# EAGLE design lipo_charger (EAGLE 7.5.0)
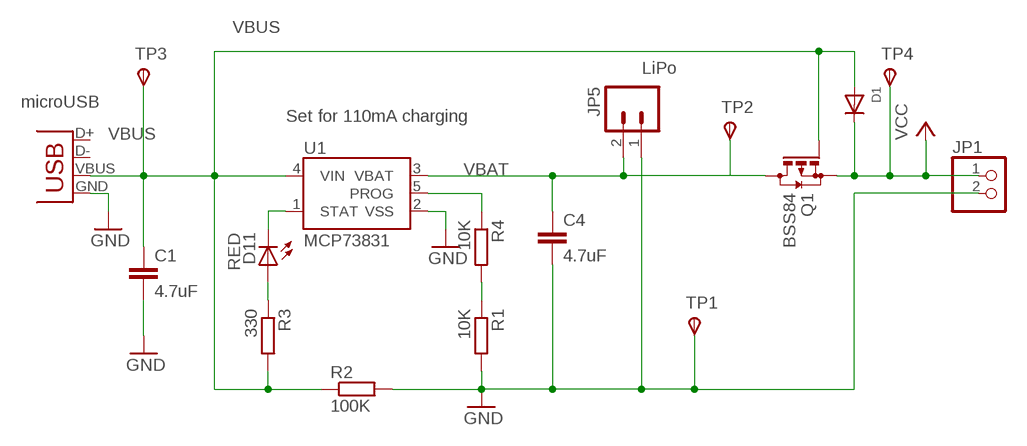
[diagram p0: schematic, sheet 1]

## Parts
C1  4.7uF  C-EUC0805  [C0805]
C4  4.7uF  C-EUC0805  [C0805]
D1  DIODESOD-123  [SOD-123]
D11  RED  LED1206  [LED-1206]
JP1  PINHD-1X2  [1X02]
JP5  LiPo  M02JST-PTH-2  [JST-2-PTH]
Q1  BSS84  [SOT23]
R1  10K  R-EU_R0805  [R0805]
R2  100K  R-EU_R0805  [R0805]
R3  330  R-EU_R0805  [R0805]
R4  10K  R-EU_R0805  [R0805]
TP1  TPSTP09R  [TP09R]
TP2  TPSTP09R  [TP09R]
TP3  TPSTP09R  [TP09R]
TP4  TPSTP09R  [TP09R]
U1  MCP73831  [SOT23-5]
X1  Mini USB B  USBOLD  [USB-MINIB-OLD]

## Nets
N$3: D11.A R3.1
PROG: R4.1 U1.5(PROG)
PROGA: R1.1 R4.2
STAT: D11.C U1.1(STAT)
VBAT [VCC]: C4.1 JP5.2 Q1.3(D) TP2.TP(PP) U1.3(VBAT)
VBUS [VCC]: C1.1 D1.A Q1.1(G) R2.1 R3.2 TP3.TP(PP) U1.4(VIN) X1.VBUS
VCC [VCC]: D1.C JP1.1 Q1.2(S) TP4.TP(PP)
VSS [GND]: C1.2 C4.2 JP1.2 JP5.1 R1.2 R2.2 TP1.TP(PP) U1.2(VSS) X1.GND ; supply symbol labelled GND
Unconnected: X1.D+ X1.D-

## Notes on the sheet
- microUSB
- Set for 110mA charging

## Library data of the parts
C1 C4 = resistor:C-EU: CAPACITOR, European symbol
D1 = adafruit:DIODE: Diode SMADIODE - SMA Surface Mount Package 20V 1A Schottky Diode Digikey: 641-1014-6-ND DO-1N4148 - Through Hole Small Current Diode SOD-123 20V 1 A (.5mV Vf) Schottky Diode - Digikey: MBRX120TPMSCT-ND SOD-323 10V 570mA (.38mV Vf, 3ns) Schottky Diode - Digikey: ZLLS410CT-ND SOD-523 30V 30mA Schottky Diode (RB751S-40TE61) - Digikey: RB751S-40TE61CT-ND SOT23-R/W - SOT23 Package (R = Solder Paste/Reflow Ovens, W = Hand-Soldering) BAT54Film 40V 300mA - Digikey: 497-7162-1-ND
D11 = SparkFun:LED: LEDs Standard schematic elements and footprints for 5mm, 3mm, 1206, and 0603 sized LEDs. 5mm - Spark Fun Electronics SKU : COM-00529 (and others)
JP1 = pinhead:PINHD-1X2: PIN HEADER
JP5 = SparkFun:M02: Header 2 Standard 2-pin 0.1" header. Use with straight break away headers (SKU : PRT-00116), right angle break away headers (PRT-00553), swiss pins (PRT-00743), machine pins (PRT-00117), and female headers (PRT-00115). Molex polarized connector foot print use with SKU : PRT-08233 with associated crimp pins and housings.
Q1 = transistor-small-signal:BSS84: P-CHANNEL MOS FET
R1-R4 = resistor:R-EU_: RESISTOR, European symbol
TP1-TP4 = testpad:TPS: TEST PIN
U1 = SparkFun:MCP73831: Microchip's MCP73831 Miniature single cell, fully integrated Li-Ion, Li-polymer charge management controller http://ww1.microchip.com/downloads/en/DeviceDoc/21984a.pdf
X1 = SparkFun:USB: USB Connectors USB-B-PTH is fully proven SKU : PRT-00139 USB-miniB is fully proven SKU : PRT-00587 USB-A-PCB is untested. USB-A-H is throughly reviewed, but untested. Spark Fun Electronics SKU : PRT-00437 USB-B-SMT is throughly reviewed, but untested. Needs silkscreen touching up. USB-A-S has not been used/tested USB-MB-H has not been used/tested

## Net classes
0 default: width 0.305 mm, drill 0.508 mm, clearance 0.178 mm
1 GND: width 0.762 mm, drill 0.508 mm, clearance 0.178 mm
2 VCC: width 0.762 mm, drill 0.508 mm, clearance 0.178 mm
3 AD: width 0.305 mm, drill 0.508 mm, clearance 0.178 mm
4 VCCEXT: width 0.762 mm, drill 0.508 mm, clearance 0.178 mm

## Board
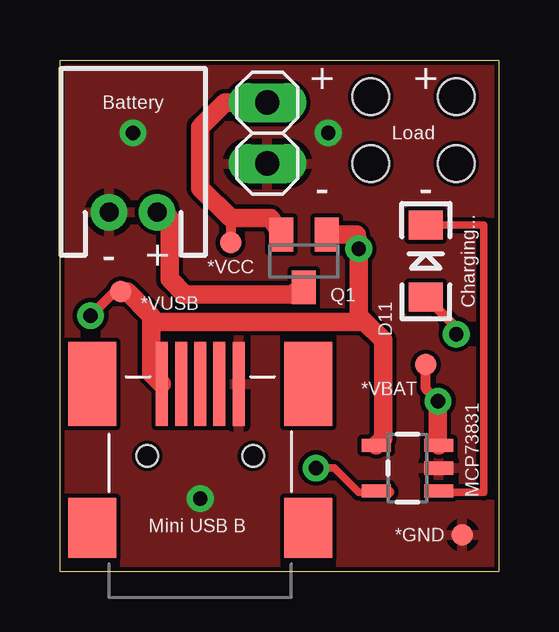
[diagram p1: board, top side]
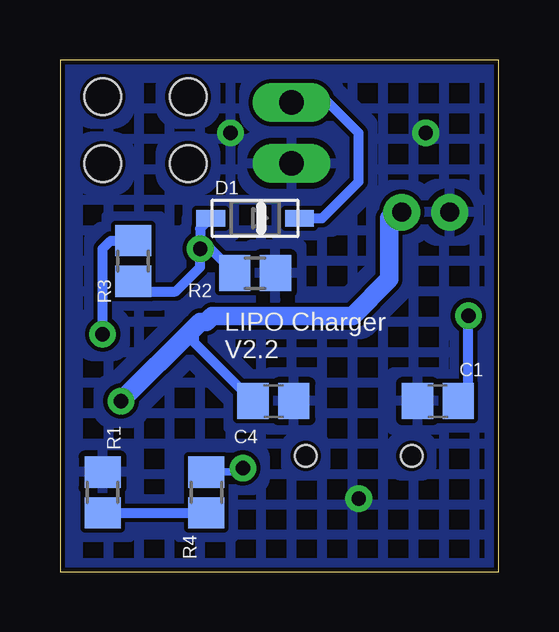
[diagram p2: board, bottom side, seen from below]

Size 18.29 x 21.34 mm. Coordinates in mm from the lower left corner, seen from the top.
Outline: 0,21.34 18.29,21.34 18.29,0 0,0 0,21.34
Copper layers (1*16): Top 0.035mm / dielectric 1.5mm / Bottom 0.035mm
Design rules "SparkFun *": minimum track width 7mil, minimum drill 20mil, track to track 7mil, track to pad 7mil, pad to pad 7mil, via to via 7mil, smd to smd 7mil, copper to edge 7mil, drill to drill 7mil, minimum pad ring 12mil, minimum via ring 10mil, stop-mask expansion 4mil, vias tented up to drill 25mil, thermal gap 10mil
Holes 1.52 mm at 16.51,19.81 16.51,17.02 12.95,17.02 12.95,19.81

### Footprints (pad centres in the part's own frame; a part is rotated, then mirrored left to right if it is on the bottom)
C0805 = smd 1.3 x 1.5: 1 -0.85,0; 2 0.85,0
SOD-123 = smd 1.2 x 0.7: A 1.85,0; C -1.85,0
LED-1206 = smd 1.2 x 1.4: A -1.5,0; C 1.5,0
1X02 = drill 1.016 long: 1 -1.27,0; 2 1.27,0
JST-2-PTH = drill 0.787 pad 1.524: 1 -1,0; 2 1,0
SOT23 = smd 1 x 1.4: 1 -0.95,-1.1; 2 0.95,-1.1; 3 0,1.1
R0805 = smd 1.3 x 1.5: 1 -0.85,0; 2 0.85,0
TP09R = smd 0.9 x 0.9: TP 0,0
SOT23-5 = smd 0.55 x 1.2: 1 -0.95,-1.3; 2 0,-1.3; 3 0.95,-1.3; 4 0.95,1.3; 5 -0.95,1.3
USB-MINIB-OLD = smd 2.5 x 2: 1 -3,-4.5; 2 -3,4.5 | smd 3.5 x 2: 3 3,-4.5; 4 3,4.5 | smd 3.5 x 0.5: D+ 3,0; D- 3,0.8; GND 3,-1.6; ID 3,-0.8; VBUS 3.01,1.61 | hole 0.9: 0,2.2; 0,-2.2

### Placement (x,y rotation side)
C1  2.54,7.11 180 bottom
C4  9.4,7.11 0 bottom
D1  10.16,14.73 180 bottom
D11  15.24,12.95 90 top
JP1  8.64,18.29 270 top
JP5  3.05,14.99 0 top
Q1  10.16,12.95 180 top
R1  16.51,3.3 90 bottom
R2  10.16,12.45 0 bottom
R3  15.24,12.95 270 bottom
R4  12.19,3.3 270 bottom
TP1  16.76,1.52 0 top
TP2  15.24,8.64 0 top
TP3  2.54,11.68 0 top
TP4  7.11,13.72 0 top
U1  14.48,4.32 90 top
X1  5.84,4.83 90 top

### Tracks (layer width: path | path; a pad name or v marks a point on that pad's centre or on a via)
N$3  (via drill 0.6)
  Top 0.406: D11.A 16.51,10.18 v16.51,9.91
  Bottom 0.406: v16.51,9.91 16.51,13.46 16.17,13.8 R3.1
PROG  (via drill 0.6)
  Top 0.305: U1.5 13.62,3.3 12.45,3.3 11.43,4.32 v10.67,4.32
  Top 0.406: U1.5 13.72,3.34 13.72,3.3
  Bottom 0.305: v10.67,4.32 10.83,4.15 R4.1
PROGA
  Bottom 0.406: R1.1 R4.2
STAT
  Top 0.305: D11.C 17.65,14.45 17.65,3.3 16.29,3.3
  Top 0.406: 16.29,3.3 U1.1
VBAT  (via drill 0.6)
  Top 0.406: v15.75,7.11 15.24,7.62 TP2.TP
  Top 0.762: U1.3 15.75,5.3 v15.75,7.11 | Q1.3 9.61,11.56 5.21,11.56 4.57,12.19 4.57,14.73 4.32,14.99 JP5.2
  Bottom 0.406: C4.1 12.7,9.56 12.7,10.16
  Bottom 0.762: v15.75,7.11 12.7,10.16 12.45,10.41 12.19,10.41 11.94,10.67 6.1,10.67 4.57,12.19 4.57,14.73 4.32,14.99 JP5.2
VBUS  (via drill 0.6)
  Top 0.406: v1.27,10.67 2.29,11.68 TP3.TP
  Top 0.762: X1.VBUS 3.81,8.26 3.81,10.41 | 3.81,10.41 3.81,10.67 2.79,11.68 TP3.TP | U1.4 13.46,5.55 13.46,9.65 12.7,10.41 | 12.7,10.41 3.81,10.41 | 12.7,10.41 12.45,10.67 v12.45,13.46 12.45,13.72 12.36,14.05 Q1.1
  Bottom 0.406: C1.1 1.27,7.53 v1.27,10.67 | D1.A 12.45,14.3 v12.45,13.46 | R2.1 12.03,13.46 v12.45,13.46 | R3.2 14.82,11.68 13.46,11.68 12.45,12.7 v12.45,13.46
VCC
  Top 0.406: 7.11,14.73 TP4.TP
  Top 0.762: Q1.2 8.79,14.73 7.11,14.73 5.84,16 5.84,18.54 6.86,19.56 JP1.1
  Bottom 0.406: D1.C 7.37,14.73 5.84,16.26 5.84,18.29 7.11,19.56 JP1.1
VSS  (via drill 0.6)
  other vias: 5.84,3.05 11.18,18.29 3.05,18.29
  pour Top: -0.38,21.84 18.67,21.84 18.67,-0.51 -0.38,-0.51
  pour Bottom (hatched): -0.38,21.84 18.67,21.84 18.67,-0.51 -0.38,-0.51

### Text on the board
tNames: + | + | Battery | Load | - | - | - | + | *VCC | Charging... | *VUSB | *VBAT | *GND
bNames: LIPO Charger / V2.2